# Altium schematic sheet OLED_Xplained_PRO_TopLevel.SchDoc: OLED Xplained PRO
size A3; Organization: ATMEL Norway; Address1: Vestre Rosten 79; Address2: N-7075 TILLER; Address3: NORWAY; DocumentNumber: 1; Revision: 3; SheetNumber: 1; SheetTotal: 2; PageSetup: Record=PageOptions|CenterHorizontal=True|CenterVertical=True|PrintScale=1.01|XCorrection=1.00|YCorrection=1.00|PrintKind=1|BorderSize=5000000|LeftOffset=0|BottomOffset=0|Orientation=2|PaperLength=1000|PaperWidth=1000|Scale=100|PaperSource=7|PrintQuality=-4|MediaType=1|DitherType=10|PaperKind=Letter|PrintScaleMode=1
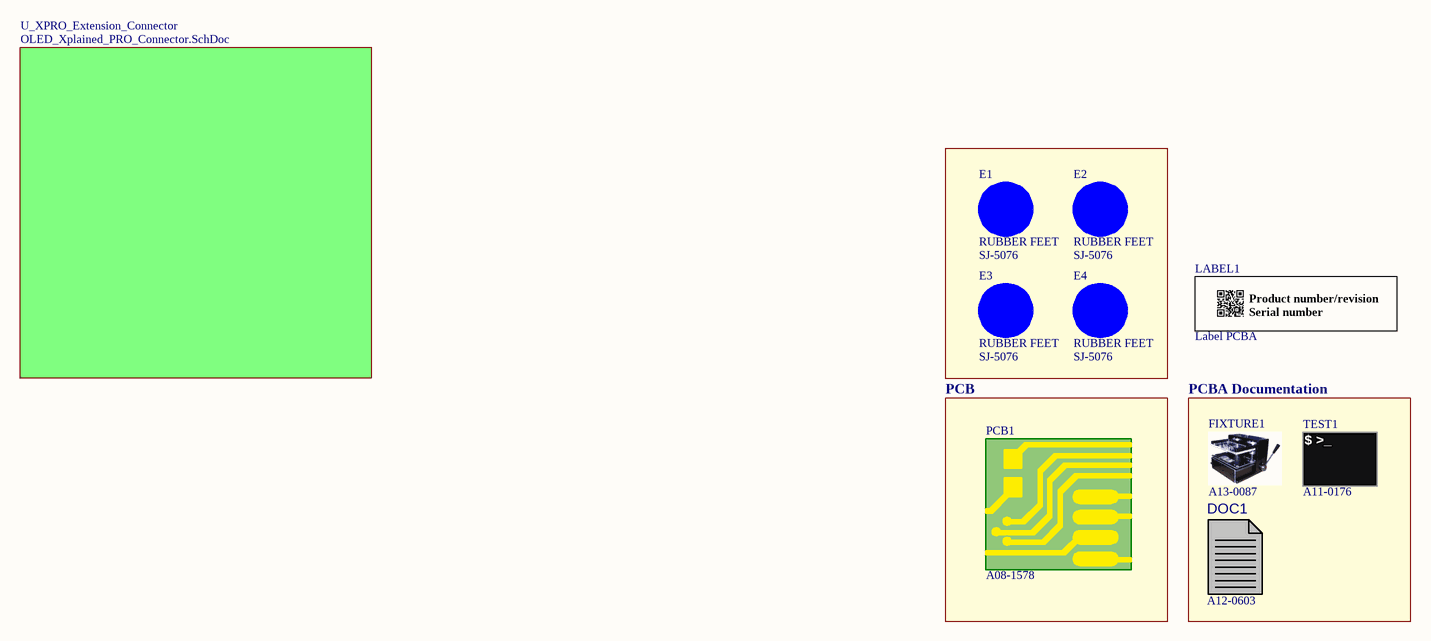
[diagram p0: OLED_Xplained_PRO_TopLevel.SchDoc]

## Parts
DOC1  AN: A12-0603  (hidden comment: PCBA Documentation)  (mechanical)
E1  RUBBER FEET  value SJ-5076  [AP8-00192]
E2  RUBBER FEET  value SJ-5076  [AP8-00192]
E3  RUBBER FEET  value SJ-5076  [AP8-00192]
E4  RUBBER FEET  value SJ-5076  [AP8-00192]
FIXTURE1  AN: A13-0087  (hidden comment: JIG)  (mechanical)
LABEL1  value Label PCBA  [AP8-00317]  (hidden comment: PCBA_LABEL)
PCB1  value A08-1578  (mechanical)
TEST1  AN: A11-0176  (hidden comment: TEST)  (mechanical)

## Blocks framed on the sheet
PCB: PCB1
PCBA Documentation: DOC1 FIXTURE1 TEST1

## Sub-sheets
U_XPRO_Extension_Connector = OLED_Xplained_PRO_Connector.SchDoc: no entries

## Nets

Not connected (* = marked no-connect by the designer): E1 1(FIDUCIAL); E2 1(FIDUCIAL); E3 1(FIDUCIAL); E4 1(FIDUCIAL)

## Notes on the sheet
- Date:
- PAGE:
- of
- TITLE:
- Document number:
- Revision:
- (in symbol A09-0611) / Product number/revision / Serial number
- (in symbol A11-0176) $ >_

## Library data of the parts
DOC1 = A12-0603: OLED1 Xplained Pro PCBA documentation; PartGroup: Documentation,PCBA Documents,Atmel; Manufacturer: ATMEL; Value: A09-1769 PCBA Files
E1-E4 = A08-0053: 2.8mm adhesive feet,diam 8.0mm; PartGroup: Mechanical devices,Mounting accessories; Manufacturer: 3M; AN: A08-0053; Height: 2,79999995231628; MPN: SJ-5076
FIXTURE1 = A13-0087: Xplained PRO Extension board Jupiter Test Fixture; PartGroup: Test Equipment,Test Fixtures; Manufacturer: ESCATEC; Value: Xplained PRO Extension board Jupiter Test Fixture; MPN: Xplained PRO Extension board Jupiter Test Fixture
LABEL1 = A09-0611: PCBA identification label PP Top White Gloss; PartGroup: Mechanical devices,Packaging materials,Printed Labels; Manufacturer: ACT Logimark AS; MPN: 505462; AN: A09-0611
PCB1 = A08-1578: OLED1 Xplained Pro PCB, 2 layer, size 60mm x 66.5mm; PartGroup: Mechanical devices,Printed circuit boards; Manufacturer: NCAB; AN: A08-1578; Height: 1.60000002384186
TEST1 = A11-0176: Fixture test for OLED1 Xplained PRO; PartGroup: Software,Test software,Starter Kit; Manufacturer: ATMEL; Value: OLED1 Xplained PRO test